# Altium schematic sheet ADC.SchDoc
size A4; CompanyName: TH Nürnberg; Organization: UltraZohm; Address1: Kesslerplatz 12; Address2: 90489 Nürnberg; Address3: GERMANY; SheetNumber: 5; SheetTotal: 10
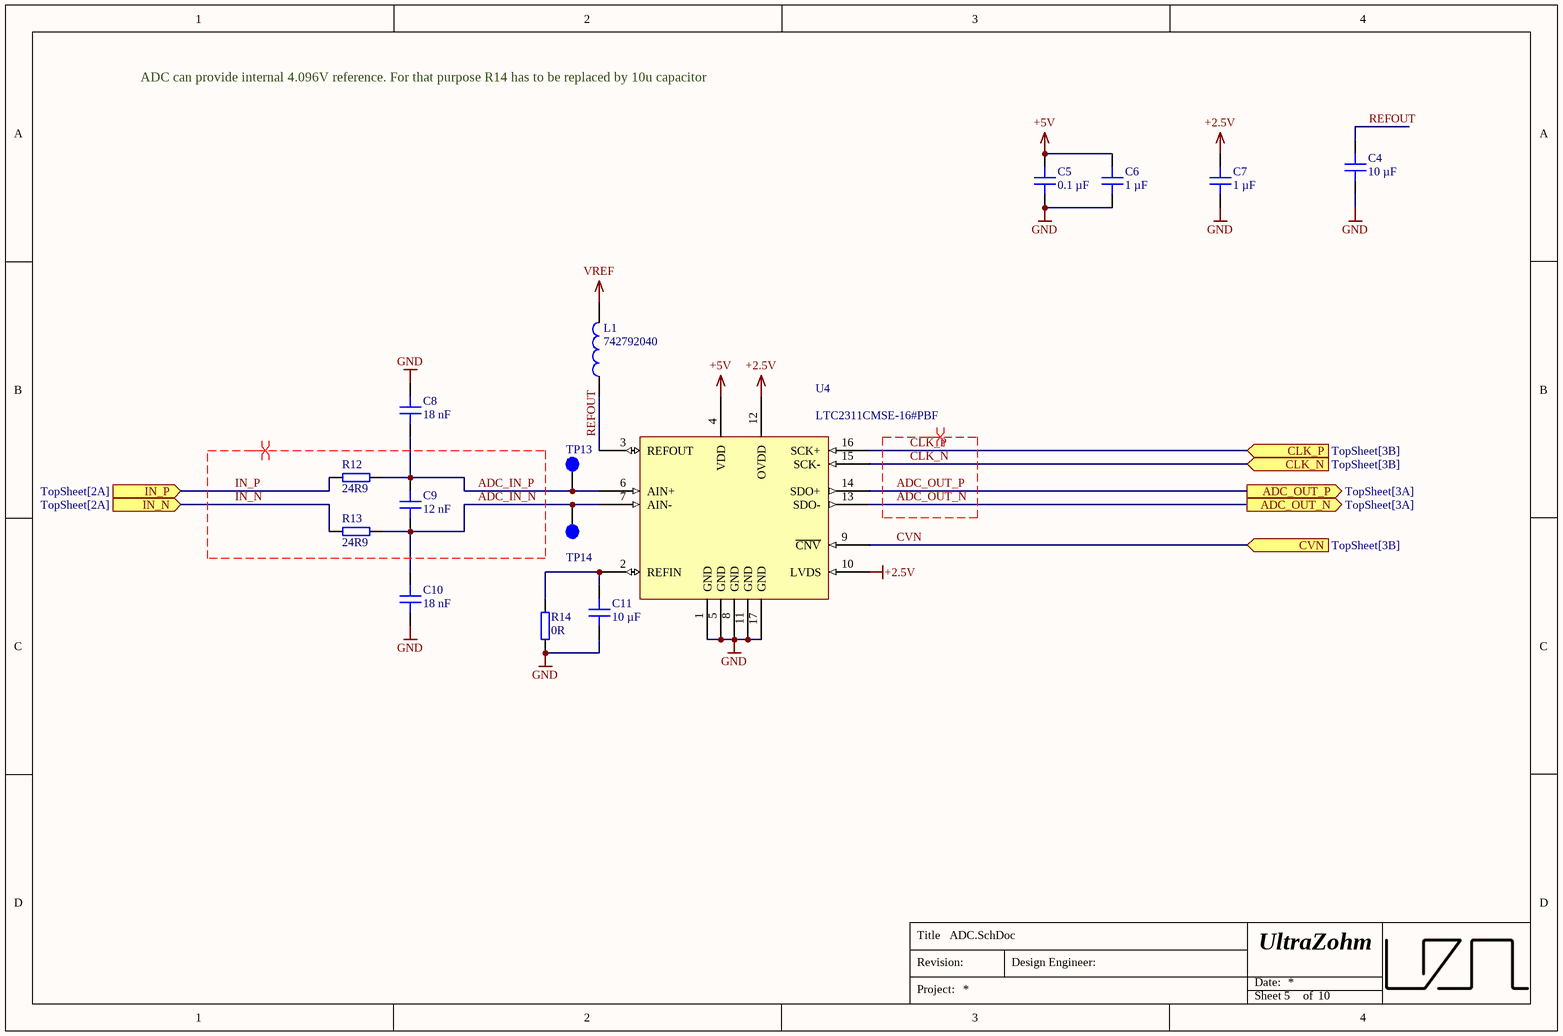
[diagram p0: ADC.SchDoc]

## Parts
C4  10 µF  [C_0805]
C5  0.1 µF  [C_0603]
C6  1 µF  [C_0603]
C7  1 µF  [C_0603]
C8  18 nF  [C_0603]
C9  12 nF  [C_0603]
C10  18 nF  [C_0603]
C11  10 µF  [C_0805]
L1  742792040  [WE-CBF_0805_High Current]
R12  24R9  [RES 0603_1608]
R13  24R9  [RES 0603_1608]
R14  0R  [RES 0603_1608]
TP13  -  [TP_1mm]  (value not drawn)
TP14  -  [TP_1mm]  (value not drawn)
U4  LTC2311CMSE-16#PBF  [TSSOP50P510X110_HS-17N]

## Ports
ADC_OUT_N (out, see TopSheet[3A]), ADC_OUT_P (out, see TopSheet[3A]), CLK_N (in, see TopSheet[3B]), CLK_P (in, see TopSheet[3B]), CVN (in, see TopSheet[3B]), IN_N (in, see TopSheet[2A]), IN_P (in, see TopSheet[2A])

## Nets
+2.5V: C7.2 U4.10(LVDS) U4.12(OVDD)
+5V: C5.2 C6.2 U4.4(VDD)
GND: C4.1 C5.1 C6.1 C7.1 C8.2 C10.1 C11.1 R14.1 U4.1(GND) U4.5(GND) U4.8(GND) U4.11(GND) U4.17(GND)
VREF: L1.2
ADC_IN_N: C9.1 C10.2 R13.2 TP14.1 U4.7(AIN-)
ADC_IN_P: C8.1 C9.2 R12.2 TP13.1 U4.6(AIN+)
ADC_OUT_N: U4.13(SDO-) ; port ADC_OUT_N
ADC_OUT_P: U4.14(SDO+) ; port ADC_OUT_P
CLK_N: U4.15(SCK-) ; port CLK_N
CLK_P: U4.16(SCK+) ; port CLK_P
CVN: U4.9(~{CNV}) ; port CVN
IN_N: R13.1 ; port IN_N
IN_P: R12.1 ; port IN_P
REFOUT: C4.2 L1.1 U4.3(REFOUT)
NetC11_2: C11.2 R14.2 U4.2(REFIN)

## Layout directives
differential pair: ADC_IN_N, ADC_IN_P, ADC_OUT_N, ADC_OUT_P, CLK_N, CLK_P, IN_N, IN_P

## Notes on the sheet
- ADC can provide internal 4.096V reference. For that purpose R14 has to be replaced by 10u capacitor
- Title
- Revision:
- Design Engineer:
- Date:
- Project:
- Sheet
- of

## Library data of the parts
C4 C11 = GRM219R61E106KA12D: Capacitor 0805, 25 VDC, 10 µF, X5R; Manufacturer: muRata; Tolerance: 10 %; Voltage Rating: 25 VDC; Created from: MGremer; Manufacturer Part Number: GRM219R61E106KA12D; PartID: 13; Created On: 20.12.2020 13:54:13; ComponentLink1Description: Datasheet; ComponentLink1URL: https://www.mouser.de/datasheet/2/281/murata_03052018_GRM_Series_1-1310166.pdf; Component Type: Capacitor 0805; Device Package: 0805; Last Updated: 20.12.2020 16:34:30; Mounting Type: SMD; Operating Temperature: -55 - 85°C; Series: GRM; Supplier 1: Mouser; Supplier Part Number 1: 81-GRM219R61E106KA2D; Type: Capacitor; Value: 10 µF; Live Cycle Status: 1; Stock number: Labor SMD Container
C5 = C0603X104K5RAC7411: Capacitor 0603, 50 VDC, 0.1 µF, X7R; Manufacturer: KEMET; Tolerance: 10 %; Voltage Rating: 50 VDC; Created from: MGremer; Manufacturer Part Number: C0603X104K5RAC7411; PartID: 3; Created On: 20.12.2020 13:54:13; ComponentLink1Description: Datasheet; ComponentLink1URL: https://www.mouser.de/datasheet/2/212/1/KEM_C1013_X7R_FT_CAP_SMD-1103280.pdf; Component Type: Capacitor 0603; Device Package: 0603; Last Updated: 04.03.2021 09:24:28; Mounting Type: SMD; Operating Temperature: -55 - 125°C; Series: SMD Comm X7R Flex; Supplier 1: Mouser; Supplier Part Number 1: 80-C0603X104K5R7411; Supplier 2: LCSC; Supplier Part Number 2: C14663; Type: Capacitor; Value: 0.1 µF; Live Cycle Status: 1; LCSC Part Number: C14663; Stock number: Labor SMD Container
C6 C7 = JMK107BJ105MA-T: Capacitor 0603, 6.3 VDC, 1 µF, X7R; Manufacturer: Tajyo Yuden; Tolerance: 20 %; Voltage Rating: 6.3 VDC; Created from: MGremer; Manufacturer Part Number: JMK107BJ105MA-T; PartID: 48; Created On: 20.12.2020 13:54:13; ComponentLink1Description: Datasheet; ComponentLink1URL: https://www.mouser.de/datasheet/2/396/mlcc02_e-1307760.pdf; Component Type: Capacitor 0603; Device Package: 0603; Last Updated: 20.12.2020 16:43:29; Mounting Type: SMD; Operating Temperature: -55 - 85°C; Series: CC; Supplier 1: Mouser; Supplier Part Number 1: 963-JMK107BJ105MA-T; Type: Capacitor; Value: 1 µF; Live Cycle Status: 1; Stock number: not stored
C8 C10 = C0603C183K4RACTU: Capacitor 0603, 16 VDC, 18 nF, X7R; Manufacturer: KEMET; Tolerance: 10 %; Voltage Rating: 16 VDC; Created from: MGremer; Manufacturer Part Number: C0603C183K4RACTU; PartID: 46; Created On: 20.12.2020 13:54:13; ComponentLink1Description: Datasheet; ComponentLink1URL: https://www.mouser.de/datasheet/2/212/KEM_C1002_X7R_SMD-1102033.pdf; Component Type: Capacitor 0603; Device Package: 0603; Last Updated: 08.10.2021 08:30:37; Mounting Type: SMD; Operating Temperature: -55 - 125°C; Series: SMD Comm X7R; Supplier 1: Mouser; Supplier Part Number 1: 80-C0603C183K4R; Type: Capacitor; Value: 18 nF; Live Cycle Status: 1; Stock number: not stored
C9 = CC0603KRX7R7BB123: Capacitor 0603, 16 VDC, 12 nF, X7R; Manufacturer: Yageo; Tolerance: 10 %; Voltage Rating: 16 VDC; Created from: MGremer; Manufacturer Part Number: CC0603KRX7R7BB123; PartID: 47; Created On: 20.12.2020 13:54:13; ComponentLink1Description: Datasheet; ComponentLink1URL: https://www.mouser.de/datasheet/2/447/UPY-GPHC_X7R_6.3V-to-50V_18-1154002.pdf; Component Type: Capacitor 0603; Device Package: 0603; Last Updated: 08.10.2021 08:31:49; Mounting Type: SMD; Operating Temperature: -55 - 125°C; Series: CC; Supplier 1: Mouser; Supplier Part Number 1: 603-CC603KRX7R7BB123; Type: Capacitor; Value: 12 nF; Live Cycle Status: 1; Stock number: not stored
L1 = 742792040: Inductance, 0805, 100 MHz, 600 Ohm, 2 A; Manufacturer: Wurth Elektronik; Type: Inductance SMD; DC current: 2 A; Value: 600 Ohm; Created from: MGremer; Manufacturer Part Number: 742792040; PartID: 1; Created On: 18.01.2021 14:53:17; ComponentLink1Description: Datasheet; ComponentLink1URL: https://www.mouser.de/datasheet/2/445/742792040-1720361.pdf; Component Type: Inductance; Device Package: 0805; Last Updated: 18.01.2021 14:53:25; Mounting Type: SMD; Operating Temperature: -55 - 125 °C; Series: WE-CBF; Supplier 1: Mouser; Supplier Part Number 1: 710-742792040; Live Cycle Status: 1; Stock number: not stored
R12 R13 = RC0603FR-1324R9L: SMD resistor 1%; Manufacturer: Yageo; Created from: MGremer; Manufacturer Part Number: RC0603FR-1324R9L; PartID: 164; Created On: 14.12.2020 16:17:14; ComponentLink1Description: Datasheet; ComponentLink1URL: https://www.mouser.de/datasheet/2/447/PYu-RC_Group_51_RoHS_L_10-1664068.pdf; Component Type: SMD resistor; Device Package: 0603; Last Updated: 02.03.2021 14:07:32; Mounting Type: SMD; Supplier 1: Mouser; Supplier Part Number 1: 603-RC0603FR-1324R9L; Type: Resistor; Tolerance: 1%; Value: 24R9; Live Cycle Status: 1; Stock number: not stored
R14 = RC0603JR-070RL: SMD resistor E24 series; Manufacturer: YAGEO; Tolerance: 5%; Created from: MGremer; Manufacturer Part Number: RC0603JR-070RL; PartID: 1; Created On: 14.12.2020 16:17:14; ComponentLink1Description: Datasheet; ComponentLink1URL: https://www.mouser.de/datasheet/2/447/PYu-RC_Group_51_RoHS_L_10-1664068.pdf; Component Type: SMD resistor; Device Package: 0603; Last Updated: 04.03.2021 09:09:42; Mounting Type: SMD; Supplier 1: Mouser; Supplier Part Number 1: 603-RC0603JR-070RL; Supplier 2: LCSC; Supplier Part Number 2: C21189; Type: Resistor; Value: 0R; Live Cycle Status: 1; Stock number: Labor SMD Container; LCSC Part Number: C21189
TP13 TP14 = -: Test Point 1 mm; Value: TP; Created from: MGremer; Created: 2018_06_25_AGeiger; Manufacturer Part Number: -; PartID: 9; Created On: 02.03.2021 14:59:37; ComponentLink1Description: Datasheet; ComponentLink1URL: -; ComponentLink2Description: Homepage; ComponentLink2URL: -; Component Type: Test Point; Device Package: SMD; Last Updated: 08.10.2021 21:16:06; Manufacturer: -; Minimum Order: 1; Mounting Type: SMD; Supplier 1: -; Supplier Part Number 1: -; Type: Test point; Live Cycle Status: 1; Stock number: not stored
U4 = LTC2311CMSE-16#PBF: Differential Input ADC with Wide Input Common Mode Range; Manufacturer: Analog Devices; Channels: 1; Resolution: 16 bit; Value: Differential ADC; Created from: MGremer; Manufacturer Part Number: LTC2311CMSE-16#PBF; PartID: 1; Created On: 15.01.2021 12:16:53; ComponentLink1Description: Datasheet; ComponentLink1URL: https://www.mouser.de/datasheet/2/609/231116fa-1271771.pdf; Component Type: ADC; Device Package: MSOP-16; Last Updated: 19.02.2021 13:47:16; Mounting Type: SMD; Operating Temperature: -40 - 125 °C; Supplier 1: Mouser; Supplier Part Number 1: 584-C2311CMSE-16PBF; Type: ADC; Live Cycle Status: 1; Stock number: not stored